# EAGLE design TI TS5Axx (EAGLE 9.0.0)
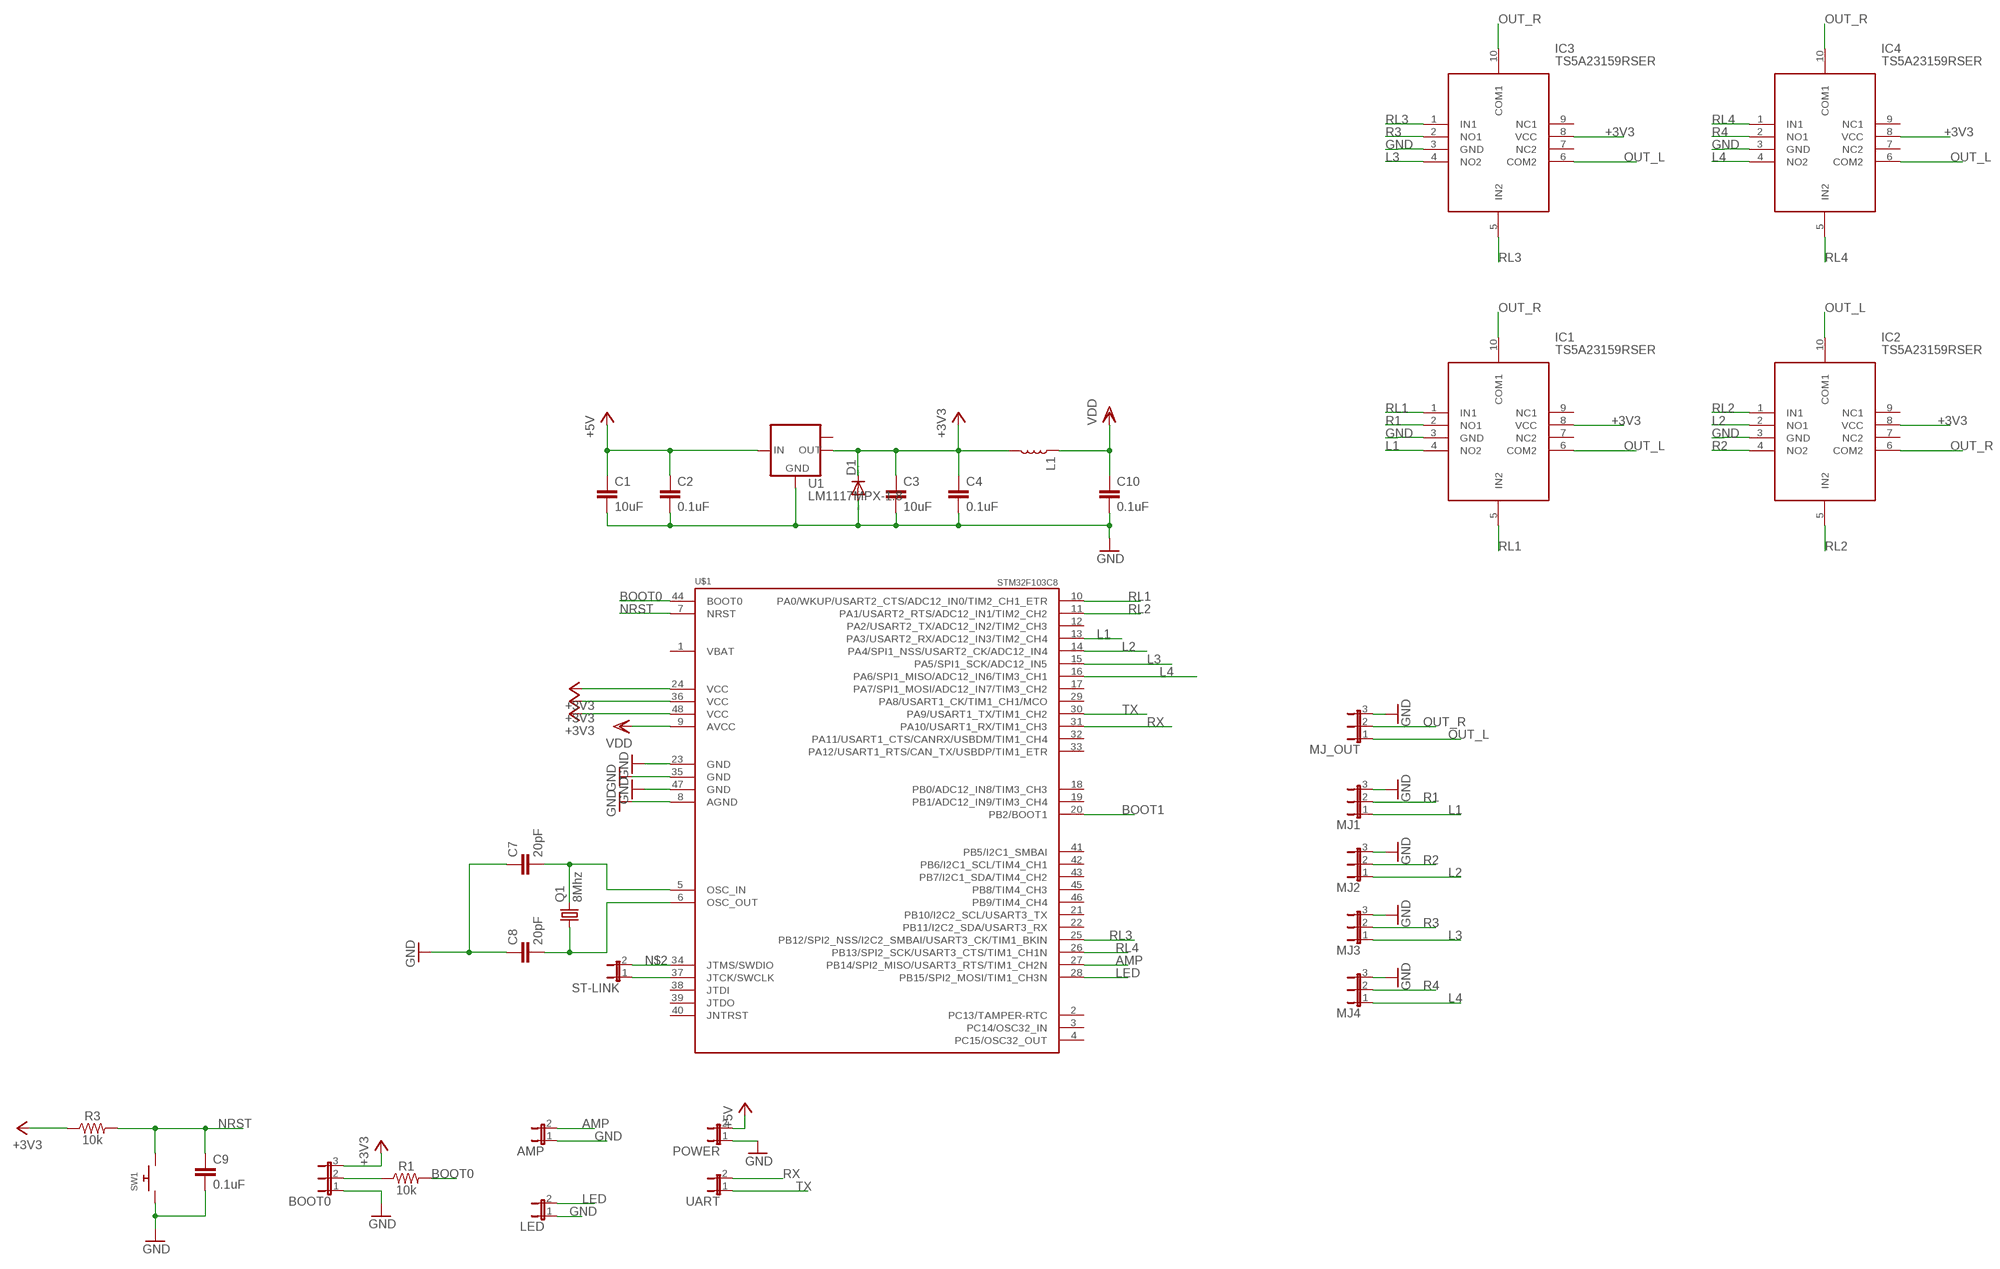
[diagram p0: schematic, sheet 1]

## Parts
AMP  JP1E  [JP1]
BOOT0  JP2E  [JP2]
C1  10uF  10UF-0805-10V-10%  [0805]
C2  0.1uF  10UF-0805-10V-10%  [0805]
C3  10uF  10UF-0805-10V-10%  [0805]
C4  0.1uF  10UF-0805-10V-10%  [0805]
C7  20pF  0.33UF/330NF-0805-50V-10%  [0805]
C8  20pF  0.33UF/330NF-0805-50V-10%  [0805]
C9  0.1uF  10UF-0805-10V-10%  [0805]
C10  0.1uF  10UF-0805-10V-10%  [0805]
D1  DIODE-DO214AA  [DO214AA]
IC1  TS5A23159RSER  [QFN50P150X200X60-10N]
IC2  TS5A23159RSER  [QFN50P150X200X60-10N]
IC3  TS5A23159RSER  [QFN50P150X200X60-10N]
IC4  TS5A23159RSER  [QFN50P150X200X60-10N]
L1  INDUCTORFB-30OHM  [0603]
LED  JP1E  [JP1]
MJ1  JP2E  [JP2]
MJ2  JP2E  [JP2]
MJ3  JP2E  [JP2]
MJ4  JP2E  [JP2]
MJ_OUT  JP2E  [JP2]
POWER  JP1E  [JP1]
Q1  8Mhz  CRYSTALHC49S  [HC49/S]
R1  10k  10KOHM-0603-1/10W-1%  [0603]
R3  10k  10KOHM-0603-1/10W-1%  [0603]
ST-LINK  JP1E  [JP1]
SW1  SWITCH_PUSHBUTTONEVQ-PE  [TACT_PANA-EVQ]
U1  LM1117MPX-1.8  [SOT223]
U$1  STM32F103C8  [LQFP48-7X7]
UART  JP1E  [JP1]

## Nets
+3V3: BOOT0.3 C3.1 C4.1 D1.C IC1.8(VCC) IC2.8(VCC) IC3.8(VCC) IC4.8(VCC) L1.2 R3.1 U1.2(OUT) U$1.24(VCC) U$1.36(VCC) U$1.48(VCC)
+5V: C1.1 C2.1 POWER.2 U1.3(IN)
AMP: AMP.2 U$1.27(PB14/SPI2_MISO/USART3_RTS/TIM1_CH2N)
BOOT0: R1.2 U$1.44(BOOT0)
BOOT1: U$1.20(PB2/BOOT1)
GND: AMP.1 BOOT0.1 C1.2 C2.2 C3.2 C4.2 C7.1 C8.1 C9.2 C10.2 D1.A IC1.3(GND) IC2.3(GND) IC3.3(GND) IC4.3(GND) LED.1 MJ1.3 MJ2.3 MJ3.3 MJ4.3 MJ_OUT.3 POWER.1 SW1.P$1 U1.1(GND) U$1.8(AGND) U$1.23(GND) U$1.35(GND) U$1.47(GND)
L1: IC1.4(NO2) MJ1.1 U$1.13(PA3/USART2_RX/ADC12_IN3/TIM2_CH4)
L2: IC2.2(NO1) MJ2.1 U$1.14(PA4/SPI1_NSS/USART2_CK/ADC12_IN4)
L3: IC3.4(NO2) MJ3.1 U$1.15(PA5/SPI1_SCK/ADC12_IN5)
L4: IC4.4(NO2) MJ4.1 U$1.16(PA6/SPI1_MISO/ADC12_IN6/TIM3_CH1)
LED: LED.2 U$1.28(PB15/SPI2_MOSI/TIM1_CH3N)
N$1: BOOT0.2 R1.1
N$2: ST-LINK.2 U$1.34(JTMS/SWDIO)
N$4: C8.2 Q1.1 U$1.6(OSC_OUT)
N$5: C7.2 Q1.2 U$1.5(OSC_IN)
N$9: ST-LINK.1 U$1.37(JTCK/SWCLK)
NRST: C9.1 R3.2 SW1.P$2 U$1.7(NRST)
OUT_L: IC1.6(COM2) IC2.10(COM1) IC3.6(COM2) IC4.6(COM2) MJ_OUT.1
OUT_R: IC1.10(COM1) IC2.6(COM2) IC3.10(COM1) IC4.10(COM1) MJ_OUT.2
R1: IC1.2(NO1) MJ1.2
R2: IC2.4(NO2) MJ2.2
R3: IC3.2(NO1) MJ3.2
R4: IC4.2(NO1) MJ4.2
RL1: IC1.1(IN1) IC1.5(IN2) U$1.10(PA0/WKUP/USART2_CTS/ADC12_IN0/TIM2_CH1_ETR)
RL2: IC2.1(IN1) IC2.5(IN2) U$1.11(PA1/USART2_RTS/ADC12_IN1/TIM2_CH2)
RL3: IC3.1(IN1) IC3.5(IN2) U$1.25(PB12/SPI2_NSS/I2C2_SMBAI/USART3_CK/TIM1_BKIN)
RL4: IC4.1(IN1) IC4.5(IN2) U$1.26(PB13/SPI2_SCK/USART3_CTS/TIM1_CH1N)
RX: U$1.31(PA10/USART1_RX/TIM1_CH3) UART.2
TX: U$1.30(PA9/USART1_TX/TIM1_CH2) UART.1
VDD: C10.1 L1.1 U$1.9(AVCC)
Unconnected: IC1.7(NC2) IC1.9(NC1) IC2.7(NC2) IC2.9(NC1) IC3.7(NC2) IC3.9(NC1) IC4.7(NC2) IC4.9(NC1) U1.TAB(OUT1) U$1.2(PC13/TAMPER-RTC) U$1.3(PC14/OSC32_IN) U$1.4(PC15/OSC32_OUT) U$1.12(PA2/USART2_TX/ADC12_IN2/TIM2_CH3) U$1.17(PA7/SPI1_MOSI/ADC12_IN7/TIM3_CH2) U$1.18(PB0/ADC12_IN8/TIM3_CH3) U$1.19(PB1/ADC12_IN9/TIM3_CH4) U$1.21(PB10/I2C2_SCL/USART3_TX) U$1.22(PB11/I2C2_SDA/USART3_RX) U$1.29(PA8/USART1_CK/TIM1_CH1/MCO) U$1.32(PA11/USART1_CTS/CANRX/USBDM/TIM1_CH4) U$1.33(PA12/USART1_RTS/CAN_TX/USBDP/TIM1_ETR) U$1.38(JTDI) U$1.39(JTDO) U$1.40(JNTRST) U$1.41(PB5/I2C1_SMBAI) U$1.42(PB6/I2C1_SCL/TIM4_CH1) U$1.43(PB7/I2C1_SDA/TIM4_CH2) U$1.45(PB8/TIM4_CH3) U$1.46(PB9/TIM4_CH4)

## Power pins joined to a net without a drawn wire
VBAT: U$1.1(VBAT)

## Library data of the parts
AMP LED POWER ST-LINK UART = jumper:JP1E: JUMPER
BOOT0 MJ1-MJ4 MJ_OUT = jumper:JP2E: JUMPER
C1 C3 = SparkFun-Capacitors:10UF: 10.0µF ceramic capacitors A capacitor is a passive two-terminal electrical component used to store electrical energy temporarily in an electric field.; PROD_ID: CAP-11330
C2 C4 C9 C10 = SparkFun-Capacitors:10UF: 10.0µF ceramic capacitors A capacitor is a passive two-terminal electrical component used to store electrical energy temporarily in an electric field.; PROD_ID: CAP-11330; VALUE: 10uF
C7 C8 = SparkFun-Capacitors:0.33UF/330NF: 0.33µF/330nF ceramic capacitors A capacitor is a passive two-terminal electrical component used to store electrical energy temporarily in an electric field.; PROD_ID: CAP-08469; VALUE: 0.33µF
D1 = diode:DIODE-: DIODE
IC1-IC4 = TS5A23159RSER:TS5A23159RSER: 2-Channel, 2:1 Analog Switch with Low On-State Resistance (1) and Powered Off Protection Source: Datasheet <http://www.ti.com/lit/gpn/ts5a23159>; DESCRIPTION: 2-Channel, 2:1 Analog Switch with Low On-State Resistance (1) and Powered Off Protection; HEIGHT: 0.6mm; MANUFACTURER_NAME: Texas Instruments; MANUFACTURER_PART_NUMBER: TS5A23159RSER
L1 = SparkFun-Coils:INDUCTOR: Inductors Resist changes in electrical current. Basically a coil of wire. SparkFun Products: SparkFun Load Cell Amplifier - HX711 <https://www.sparkfun.com/products/13879> IOIO-OTG - V2.2 <https://www.sparkfun.com/products/13613>; PROD_ID: NDUC-07859
Q1 = crystal:CRYSTAL: CRYSTAL; OC_FARNELL: 1667008; OC_NEWARK: unknown
R1 R3 = SparkFun-Resistors:10KOHM: 10kΩ resistor A resistor is a passive two-terminal electrical component that implements electrical resistance as a circuit element. Resistors act to reduce current flow, and, at the same time, act to lower voltage levels within circuits. - Wikipedia; PROD_ID: RES-00824
SW1 = adafruit:SWITCH_PUSHBUTTON: Buttons SOFTTOUCHSMD_SJ - Soft touch temporary push button (Super Junk Akihabara) Compatible with SKPMANE010 [Mouser: 688-SKPMAN] C&K_KSS = Digikey: KSS221GLFS
U1 = lm1117:LM1117MPX-*
U$1 = stm32:STM32F103C8

## Board
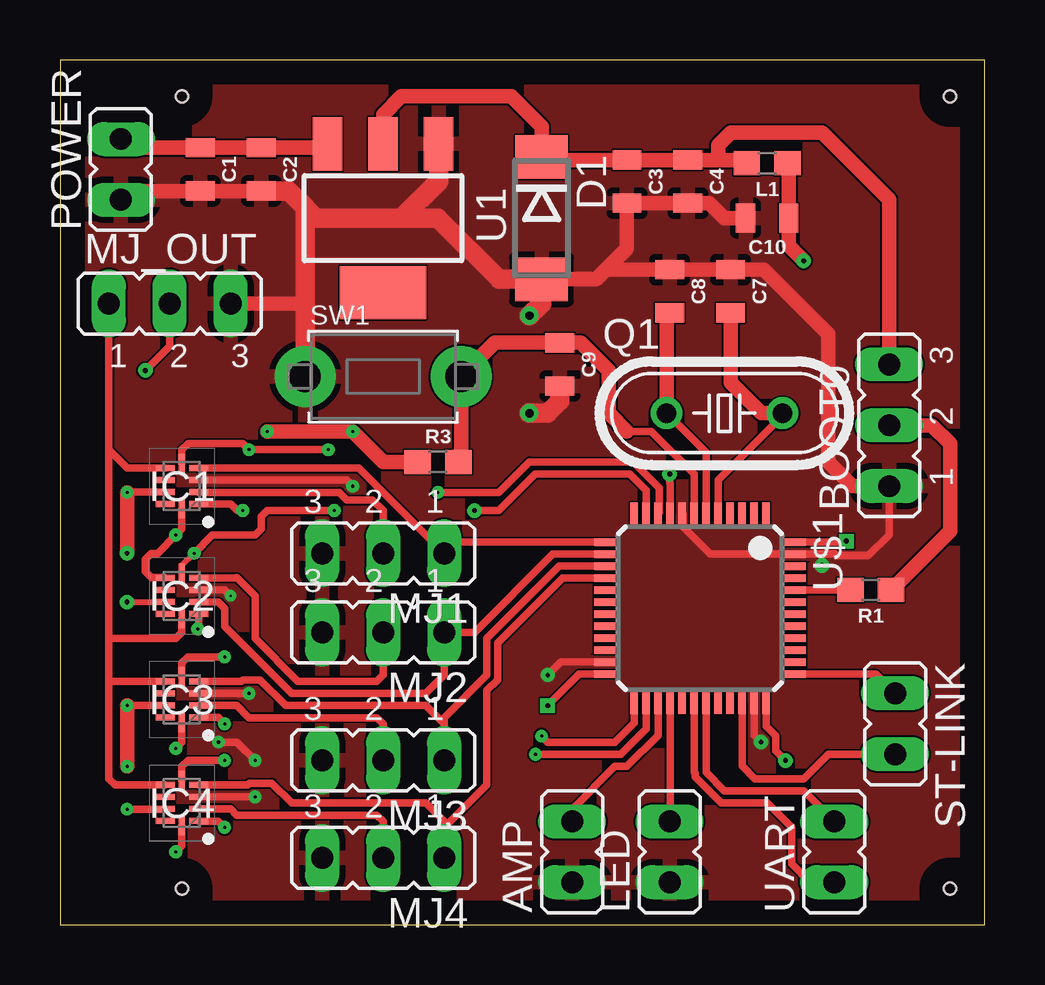
[diagram p1: board, top side]
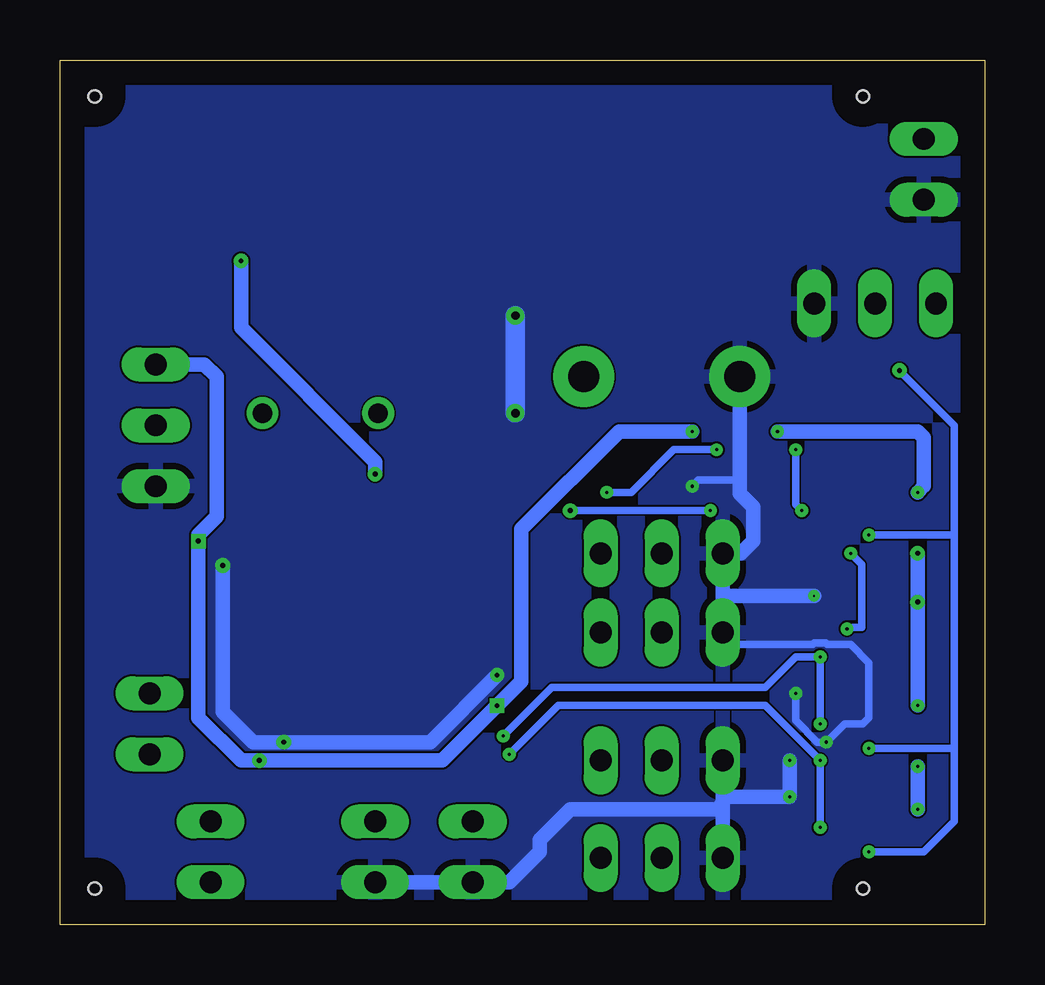
[diagram p2: board, bottom side, seen from below]

Size 38.53 x 36.06 mm. Coordinates in mm from the lower left corner, seen from the top.
Outline: 0,0 38.53,0 38.53,36.06 0,36.06 0,0
Copper layers (1*16): Top 0.035mm / dielectric 1.5mm / Bottom 0.035mm
Design rules "default *": minimum track width 6mil, minimum drill 0.01mm, track to track 3mil, track to pad 3mil, pad to pad 6mil, via to via 3mil, smd to smd 3mil, copper to edge 40mil, drill to drill 3mil, minimum pad ring 10mil, minimum via ring 8mil, stop-mask expansion 4mil, vias tented up to drill 0mil, thermal gap 10mil
Holes 0.51 mm at 37.08,1.52 37.08,34.54 5.08,34.54 5.08,1.52

### Footprints (pad centres in the part's own frame; a part is rotated, then mirrored left to right if it is on the bottom)
JP1 = drill 0.914 long: 1 0,-1.27; 2 0,1.27
JP2 = drill 0.914 long: 1 -2.54,0; 2 0,0; 3 2.54,0
0805 = smd 0.8 x 1.2: 1 -0.9,0; 2 0.9,0
DO214AA = smd 1.8 x 2.2: A 2.55,0; C -2.55,0
QFN50P150X200X60-10N = smd 0.8 x 0.25: 1 -0.7,0.75; 2 -0.7,0.25; 3 -0.7,-0.25; 4 -0.7,-0.75; 6 0.7,-0.75; 7 0.7,-0.25; 8 0.7,0.25; 9 0.7,0.75 | smd 0.25 x 0.8: 5 0,-0.95; 10 0,0.95
0603 = smd 1.1 x 1: 1 -0.85,0; 2 0.85,0
HC49/S = drill 0.813: 1 -2.413,0; 2 2.413,0
TACT_PANA-EVQ = drill 1.3 pad 2.54: P$1 -3.25,0; P$2 3.25,0
SOT223 = smd 1.219 x 2.235: 1 -2.311,-3.099; 2 0,-3.099; 3 2.311,-3.099 | smd 3.6 x 2.2: TAB 0,3.099
LQFP48-7X7 = smd 0.9 x 0.3: 1 -3.95,2.75; 2 -3.95,2.25; 3 -3.95,1.75; 4 -3.95,1.25; 5 -3.95,0.75; 6 -3.95,0.25; 7 -3.95,-0.25; 8 -3.95,-0.75; 9 -3.95,-1.25; 10 -3.95,-1.75; 11 -3.95,-2.25; 12 -3.95,-2.75; 25 3.95,-2.75; 26 3.95,-2.25; 27 3.95,-1.75; 28 3.95,-1.25; 29 3.95,-0.75; 30 3.95,-0.25; 31 3.95,0.25; 32 3.95,0.75; 33 3.95,1.25; 34 3.95,1.75; 35 3.95,2.25; 36 3.95,2.75 | smd 0.3 x 0.9: 13 -2.75,-3.95; 14 -2.25,-3.95; 15 -1.75,-3.95; 16 -1.25,-3.95; 17 -0.75,-3.95; 18 -0.25,-3.95; 19 0.25,-3.95; 20 0.75,-3.95; 21 1.25,-3.95; 22 1.75,-3.95; 23 2.25,-3.95; 24 2.75,-3.95; 37 2.75,3.95; 38 2.25,3.95; 39 1.75,3.95; 40 1.25,3.95; 41 0.75,3.95; 42 0.25,3.95; 43 -0.25,3.95; 44 -0.75,3.95; 45 -1.25,3.95; 46 -1.75,3.95; 47 -2.25,3.95; 48 -2.75,3.95

### Placement (x,y rotation side)
AMP  21.34,3.05 0 top
BOOT0  34.54,20.83 90 top
C1  5.84,31.5 270 top
C2  8.38,31.5 270 top
C3  23.62,30.99 270 top
C4  26.16,30.99 270 top
C7  27.94,26.42 270 top
C8  25.4,26.42 270 top
C9  20.83,23.37 270 top
C10  29.46,29.46 180 top
D1  20.07,29.46 270 top
IC1  5.08,18.29 180 top
IC2  5.08,13.72 180 top
IC3  5.08,9.4 180 top
IC4  5.08,5.08 180 top
L1  29.46,31.75 180 top
LED  25.4,3.05 0 top
MJ1  13.46,15.49 180 top
MJ2  13.46,12.19 180 top
MJ3  13.46,6.86 180 top
MJ4  13.46,2.79 180 top
MJ_OUT  4.57,25.91 0 top
POWER  2.54,31.5 0 top
Q1  27.69,21.34 0 top
R1  33.78,13.97 180 top
R3  15.75,19.3 0 top
ST-LINK  34.8,8.38 180 top
SW1  13.46,22.86 0 top
U1  13.46,29.46 180 top
U$1  26.67,13.21 270 top
UART  32.26,3.05 0 top

### Tracks (layer width: path | path; a pad name or v marks a point on that pad's centre or on a via)
+3V3  (via drill 0.13 pad 0.15, 0.13 pad 0.25, 0.2, 0.2 pad 0.18, 0.2 pad 0.55)
  Top 0.254: v2.79,13.46 IC2.8
  Top 0.305: v20.32,9.14 21.63,10.46 U$1.24 | U$1.48 32.72,15.96 v32.77,16 | v2.79,18.03 v2.8,18.04 IC1.8 | IC3.8 v2.79,9.14 | v2.79,4.83 IC4.8 | U$1.36 29.42,8.27 29.82,7.87 29.82,7.27 v30.23,6.86
  Top 0.61: U1.2 13.46,33.78 14.22,34.54 18.8,34.54 20.07,33.27 D1.C 20.19,31.89 C3.1 C4.1 27.43,31.89 | 27.43,31.89 28.48,31.89 L1.2 | 27.43,31.89 27.43,32.51 27.94,33.02 31.75,33.02 34.54,30.23 BOOT0.3 | R3.1 13.46,19.3 v12.19,20.57 v8.64,20.57 | v2.79,18.03 v2.79,15.49 | v2.79,9.14 v2.79,6.6
  Bottom 0.61: BOOT0.3 32.51,23.37 32,22.86 32,17.02 32.77,16.26 v32.77,16 32.77,8.64 30.99,6.86 v30.23,6.86 22.61,6.86 v20.32,9.14 19.3,10.16 19.3,16.51 15.24,20.57 v12.19,20.57 | v8.64,20.57 2.79,20.57 2.54,20.32 2.54,18.29 v2.79,18.03 | v2.79,15.49 v2.79,13.46 v2.79,9.14 | v2.79,6.6 v2.79,4.83
+5V
  Top 0.61: U1.3 10.98,32.4 C2.1 C1.1 2.91,32.4 POWER.2
AMP
  Top 0.305: AMP.2 21.34,4.83 23.11,6.6 23.62,6.6 24.92,7.9 U$1.27
BOOT0
  Top 0.305: U$1.44 32.92,13.96 R1.2
GND  (via drill 0.08 pad 0.18, 0.13 pad 0.15, 0.13 pad 0.18, 0.18, 0.2, 0.35, 0.35 pad 0.18)
  Top 0.152: 31.75,15.46 v31.75,14.99
  Top 0.305: BOOT0.1 34.54,16.26 33.68,15.39 32.34,15.39 32.27,15.46 31.75,15.46 U$1.47 27.09,15.46 25.96,16.58 25.96,17.11 U$1.8 | IC1.3 11.94,18.54 v12.19,18.29 | IC2.3 6.86,13.97 v7.11,13.72 | IC3.3 v7.87,9.65 | IC4.3 v8.12,5.33 v8.13,5.33 | v8.13,6.86 7.37,7.62 v6.6,7.62 | v20.32,10.41 20.86,10.96 U$1.23 | v29.21,7.62 28.92,7.91 U$1.35
  Top 0.61: D1.A 22.34,26.91 22.74,27.32 | 22.74,27.32 23.62,28.19 C3.2 C4.2 27.06,30.09 27.69,29.46 C10.2 | C2.2 C1.2 2.91,30.6 POWER.1 | 22.74,27.32 C8.1 C7.1 29.33,27.32 32,24.64 32,19.3 33.02,18.29 BOOT0.1 | MJ_OUT.3 10.21,25.91
  Top 0.813: C2.2 9.54,30.6 10.21,29.92 | 10.21,29.92 10.67,29.46 14.22,29.46 | 14.22,29.46 15.75,29.46 18.3,26.91 D1.A 20.07,25.91 v19.56,25.4 | U1.1 15.77,31.01 14.22,29.46 | SW1.P$1 10.21,25.91 10.21,29.92 | C9.2 20.83,21.84 20.32,21.34 v19.56,21.34
  Bottom 0.305: v12.19,18.29 11.94,18.54 10.21,18.54 | v7.87,9.65 7.87,8.52 6.97,7.62 v6.6,7.62 5.84,8.38 5.08,8.38 4.83,8.64 4.83,10.92 5.59,11.68 6.56,11.68 6.62,11.75 7.09,11.75 7.16,11.68 10.41,11.68 MJ2.3
  Bottom 0.61: SW1.P$1 10.21,18.54 10.21,17.98 9.65,17.42 9.65,16 10.16,15.49 MJ1.3 10.92,13.72 | 10.92,13.72 MJ2.3 | v7.11,13.72 10.92,13.72 | MJ3.3 10.92,5.33 | 10.92,5.33 10.92,5.08 | 10.92,5.08 MJ4.3 | 10.92,5.33 v8.13,5.33 v8.13,6.86 | 10.92,5.08 11.18,4.83 17.27,4.83 18.54,3.56 18.54,3.05 19.81,1.78 AMP.1 LED.1 | v20.32,10.41 23.11,7.62 v29.21,7.62 30.48,7.62 31.75,8.89 v31.75,14.99
  Bottom 0.813: v19.56,21.34 v19.56,25.4
  pour Bottom: 0,36.07 38.61,36.07 38.61,0 0,0
  pour Top: 0,36.07 38.61,36.07 38.61,0 0,0
L1
  Top 0.305: U$1.13 16.47,15.96 MJ1.1 12.45,19.05 11.43,19.05 11.42,19.04 IC1.4
L2
  Top 0.305: U$1.14 20.54,15.46 17.27,12.19 MJ2.1 16,10.41 15.24,9.65 9.65,9.65 6.86,12.45 6.86,13.2 6.59,13.46 IC2.2
L3
  Top 0.305: U$1.15 20.8,14.96 17.78,11.94 17.78,10.41 16,8.64 16,8.38 | MJ3.1 16,8.38 | 16,8.38 15.24,9.14 9.4,9.14 8.32,10.22 7.64,10.22 7.56,10.15 IC3.4
L4
  Top 0.305: IC4.4 7.82,5.83 7.89,5.91 8.83,5.91 9.65,5.08 15.24,5.08 16,4.32 MJ4.1 16,4.06 17.78,5.84 17.78,9.77 18.24,10.23 18.24,11.75 20.95,14.46 U$1.16
LED
  Top 0.305: LED.2 25.42,4.34 U$1.28
N$1
  Top 0.61: R1.1 37.08,16.42 37.08,20.07 36.32,20.83 BOOT0.2
N$2
  Top 0.305: U$1.34 28.42,6.63 28.96,6.1 30.99,6.1 32,7.11 ST-LINK.2
N$4
  Top 0.305: U$1.6 26.92,19.56 26.92,19.68 Q1.1
  Top 0.61: Q1.1 25.27,25.39 C8.2
N$5
  Top 0.305: Q1.2 30.1,21.21 27.43,18.54 27.43,17.17 U$1.5
  Top 0.61: Q1.2 29.21,21.34 27.94,22.61 C7.2
N$9
  Top 0.305: U$1.37 33.99,10.46 ST-LINK.1
NRST
  Top 0.305: U$1.7 26.42,18.79 24.64,20.57 23.62,20.57
  Top 0.61: 23.62,20.57 22.86,21.34 22.86,23.11 21.71,24.27 C9.1 18.12,24.27 SW1.P$2 16.71,19.42 R3.2
OUT_L
  Top 0.305: MJ_OUT.1 2.03,19.81 | IC1.6 2.81,19.04 2.03,19.81 | 2.03,19.81 2.03,11.94 | IC2.10 5.08,12.19 4.83,11.94 2.03,11.94 | 2.03,11.94 2.03,10.16 | IC3.6 4.37,10.16 2.03,10.16 | IC4.6 4.06,5.83 3.82,5.83 2.3,5.83 2.03,6.1 2.03,10.16
OUT_R  (via drill 0.13 pad 0.15, 0.13 pad 0.25, 0.2)
  Top 0.305: MJ_OUT.2 4.57,24.13 v3.56,23.11 | IC1.10 5.08,16.51 v4.83,16.26 4.06,15.49 3.81,15.49 3.56,15.24 3.56,14.73 3.81,14.48 4.37,14.48 IC2.6 | IC3.10 5.08,7.62 v4.83,7.37 | IC4.10 5.08,3.3 v4.83,3.05
  Bottom 0.305: v3.56,23.11 1.27,20.83 1.27,16.26 | v4.83,16.26 1.27,16.26 | 1.27,16.26 1.27,7.37 | 1.27,7.37 1.27,4.32 2.54,3.05 v4.83,3.05 | v4.83,7.37 1.27,7.37
R1
  Top 0.305: IC1.2 11.64,18.03 11.96,17.72 13.02,17.72 13.46,17.27 MJ1.2
R2
  Top 0.305: MJ2.2 13.46,10.41 13.21,10.16 9.91,10.16 8.13,11.94 8.13,13.72 7.37,14.48 7.35,14.47 IC2.4
R3
  Top 0.305: IC3.2 7.36,9.15 7.87,8.64 13.21,8.64 13.46,8.38 MJ3.2
R4
  Top 0.305: IC4.2 7.11,4.83 7.37,4.57 13.21,4.57 13.46,4.32 MJ4.2
RL1  (via drill 0.13 pad 0.18, 0.13 pad 0.25)
  Top 0.305: IC1.1 7.11,17.54 7.38,17.27 v7.62,17.27 | IC1.5 5.08,19.81 5.33,20.07 7.62,20.07 v7.87,19.81 v11.18,19.81 | U$1.10 24.96,17.2 24.96,18.22 23.88,19.3 19.56,19.3 18.29,18.03 v15.75,18.03
  Bottom 0.305: v7.62,17.27 7.87,17.53 v7.87,19.81 | v11.18,19.81 12.95,19.81 14.73,18.03 v15.75,18.03
RL2  (via drill 0.13 pad 0.15, 0.13 pad 0.18, 0.2)
  Top 0.254: IC2.5 5.08,14.99 v5.59,15.49
  Top 0.305: v5.59,15.49 6.35,16.26 8.13,16.26 8.38,16.51 8.38,17.02 8.64,17.27 v11.43,17.27 | v17.27,17.27 18.29,17.27 19.81,18.8 23.74,18.8 24.42,18.11 U$1.11 | 5.79,12.95 IC2.1 5.78,12.38 v5.74,12.34
  Bottom 0.305: v11.43,17.27 v17.27,17.27 | v5.74,12.34 5.69,12.39 5.13,12.39 5.13,15.04 v5.59,15.49
RL3  (via drill 0.13, 0.13 pad 0.15)
  Top 0.305: IC3.5 5.08,10.92 5.33,11.18 v6.86,11.18 | IC3.1 6.59,8.65 v6.86,8.38 | v20.07,7.87 20.32,7.62 23.11,7.62 23.92,8.43 U$1.25
  Bottom 0.305: v6.86,8.38 v6.86,11.18 7.87,11.18 9.14,9.91 18.03,9.91 v20.07,7.87
RL4  (via drill 0.13 pad 0.15)
  Top 0.305: IC4.5 5.08,6.6 5.33,6.86 v6.86,6.86 | IC4.1 6.6,4.32 v6.86,4.06 | v19.81,7.11 23.37,7.11 24.42,8.16 U$1.26
  Bottom 0.305: v6.86,4.06 v6.86,6.86 9.14,9.14 17.78,9.14 v19.81,7.11
RX
  Top 0.305: U$1.31 26.92,6.35 27.69,5.59 30.99,5.59 UART.2
TX
  Top 0.305: U$1.30 26.42,6.35 26.46,6.31 26.46,6.17 27.55,5.08 29.46,5.08 30.48,4.06 30.48,2.54 31.24,1.78 UART.1
VDD  (via drill 0.2, 0.2 pad 0.55)
  Top 0.305: v25.4,18.8 25.4,18.43 25.42,18.41 U$1.9
  Top 0.61: L1.1 30.36,31.7 C10.1 30.36,28.31 v30.99,27.69
  Bottom 0.61: v30.99,27.69 30.99,24.89 25.4,19.3 v25.4,18.8